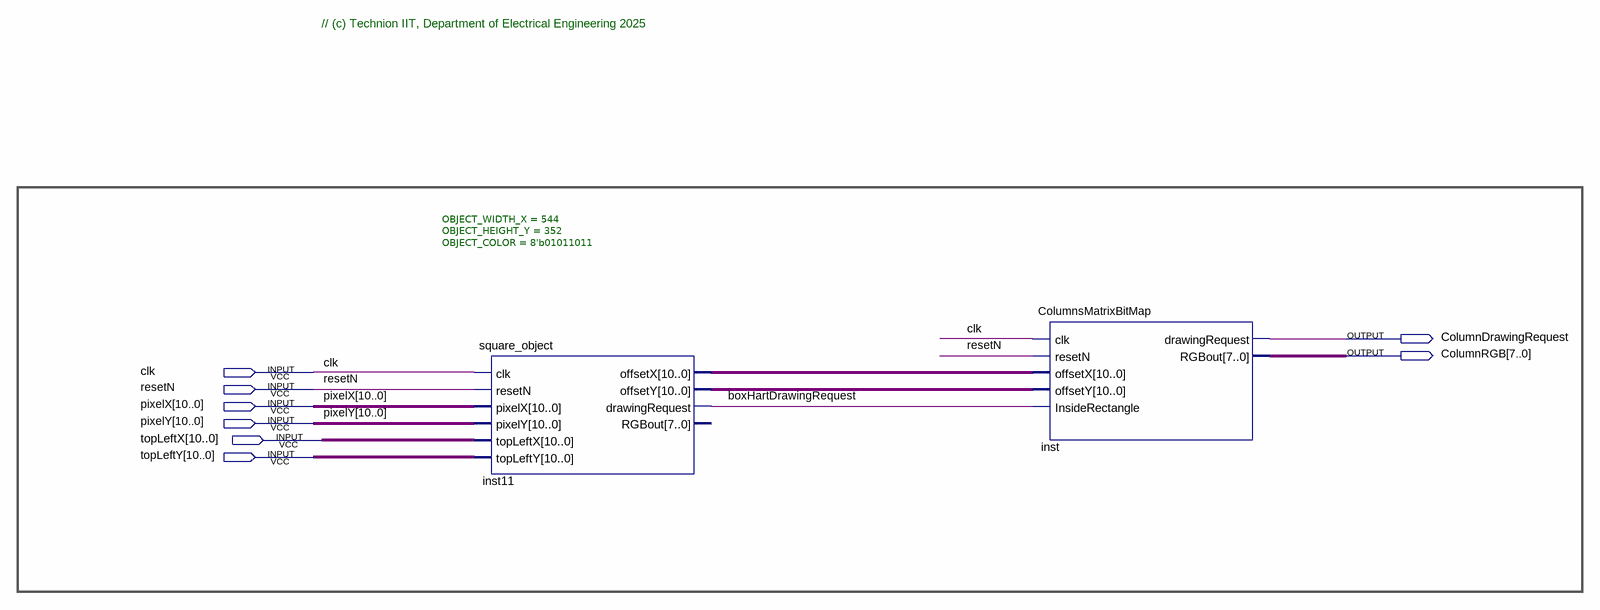
[diagram p0: schematic sheet]
// Quartus schematic COLUMNS_DISPLAY.bdf as structural Verilog: 2 symbols, 8 pins
module COLUMNS_DISPLAY (
  input  clk,
  input  resetN,
  input  [10:0] pixelX,
  input  [10:0] pixelY,
  input  [10:0] topLeftX,
  input  [10:0] topLeftY,
  output ColumnDrawingRequest,
  output [7:0] ColumnRGB
);

  wire boxHartDrawingRequest;
  wire [10:0] inst11_offsetx, inst11_offsety;

  square_object #(.OBJECT_WIDTH_X(544), .OBJECT_HEIGHT_Y(352), .OBJECT_COLOR(8'b01011011)) inst11 (
    .clk(clk), .resetN(resetN), .pixelX(pixelX), .pixelY(pixelY), .topLeftX(topLeftX), .topLeftY(topLeftY),
    .offsetX(inst11_offsetx), .offsetY(inst11_offsety), .drawingRequest(boxHartDrawingRequest));  // open: RGBout
  ColumnsMatrixBitMap inst (
    .clk(clk), .resetN(resetN), .offsetX(inst11_offsetx), .offsetY(inst11_offsety),
    .InsideRectangle(boxHartDrawingRequest), .drawingRequest(ColumnDrawingRequest), .RGBout(ColumnRGB));

  // Notes on the sheet:
  //   // (c) Technion IIT, Department of Electrical Engineering 2025
endmodule
